# EAGLE design main (EAGLE 7.7.0)
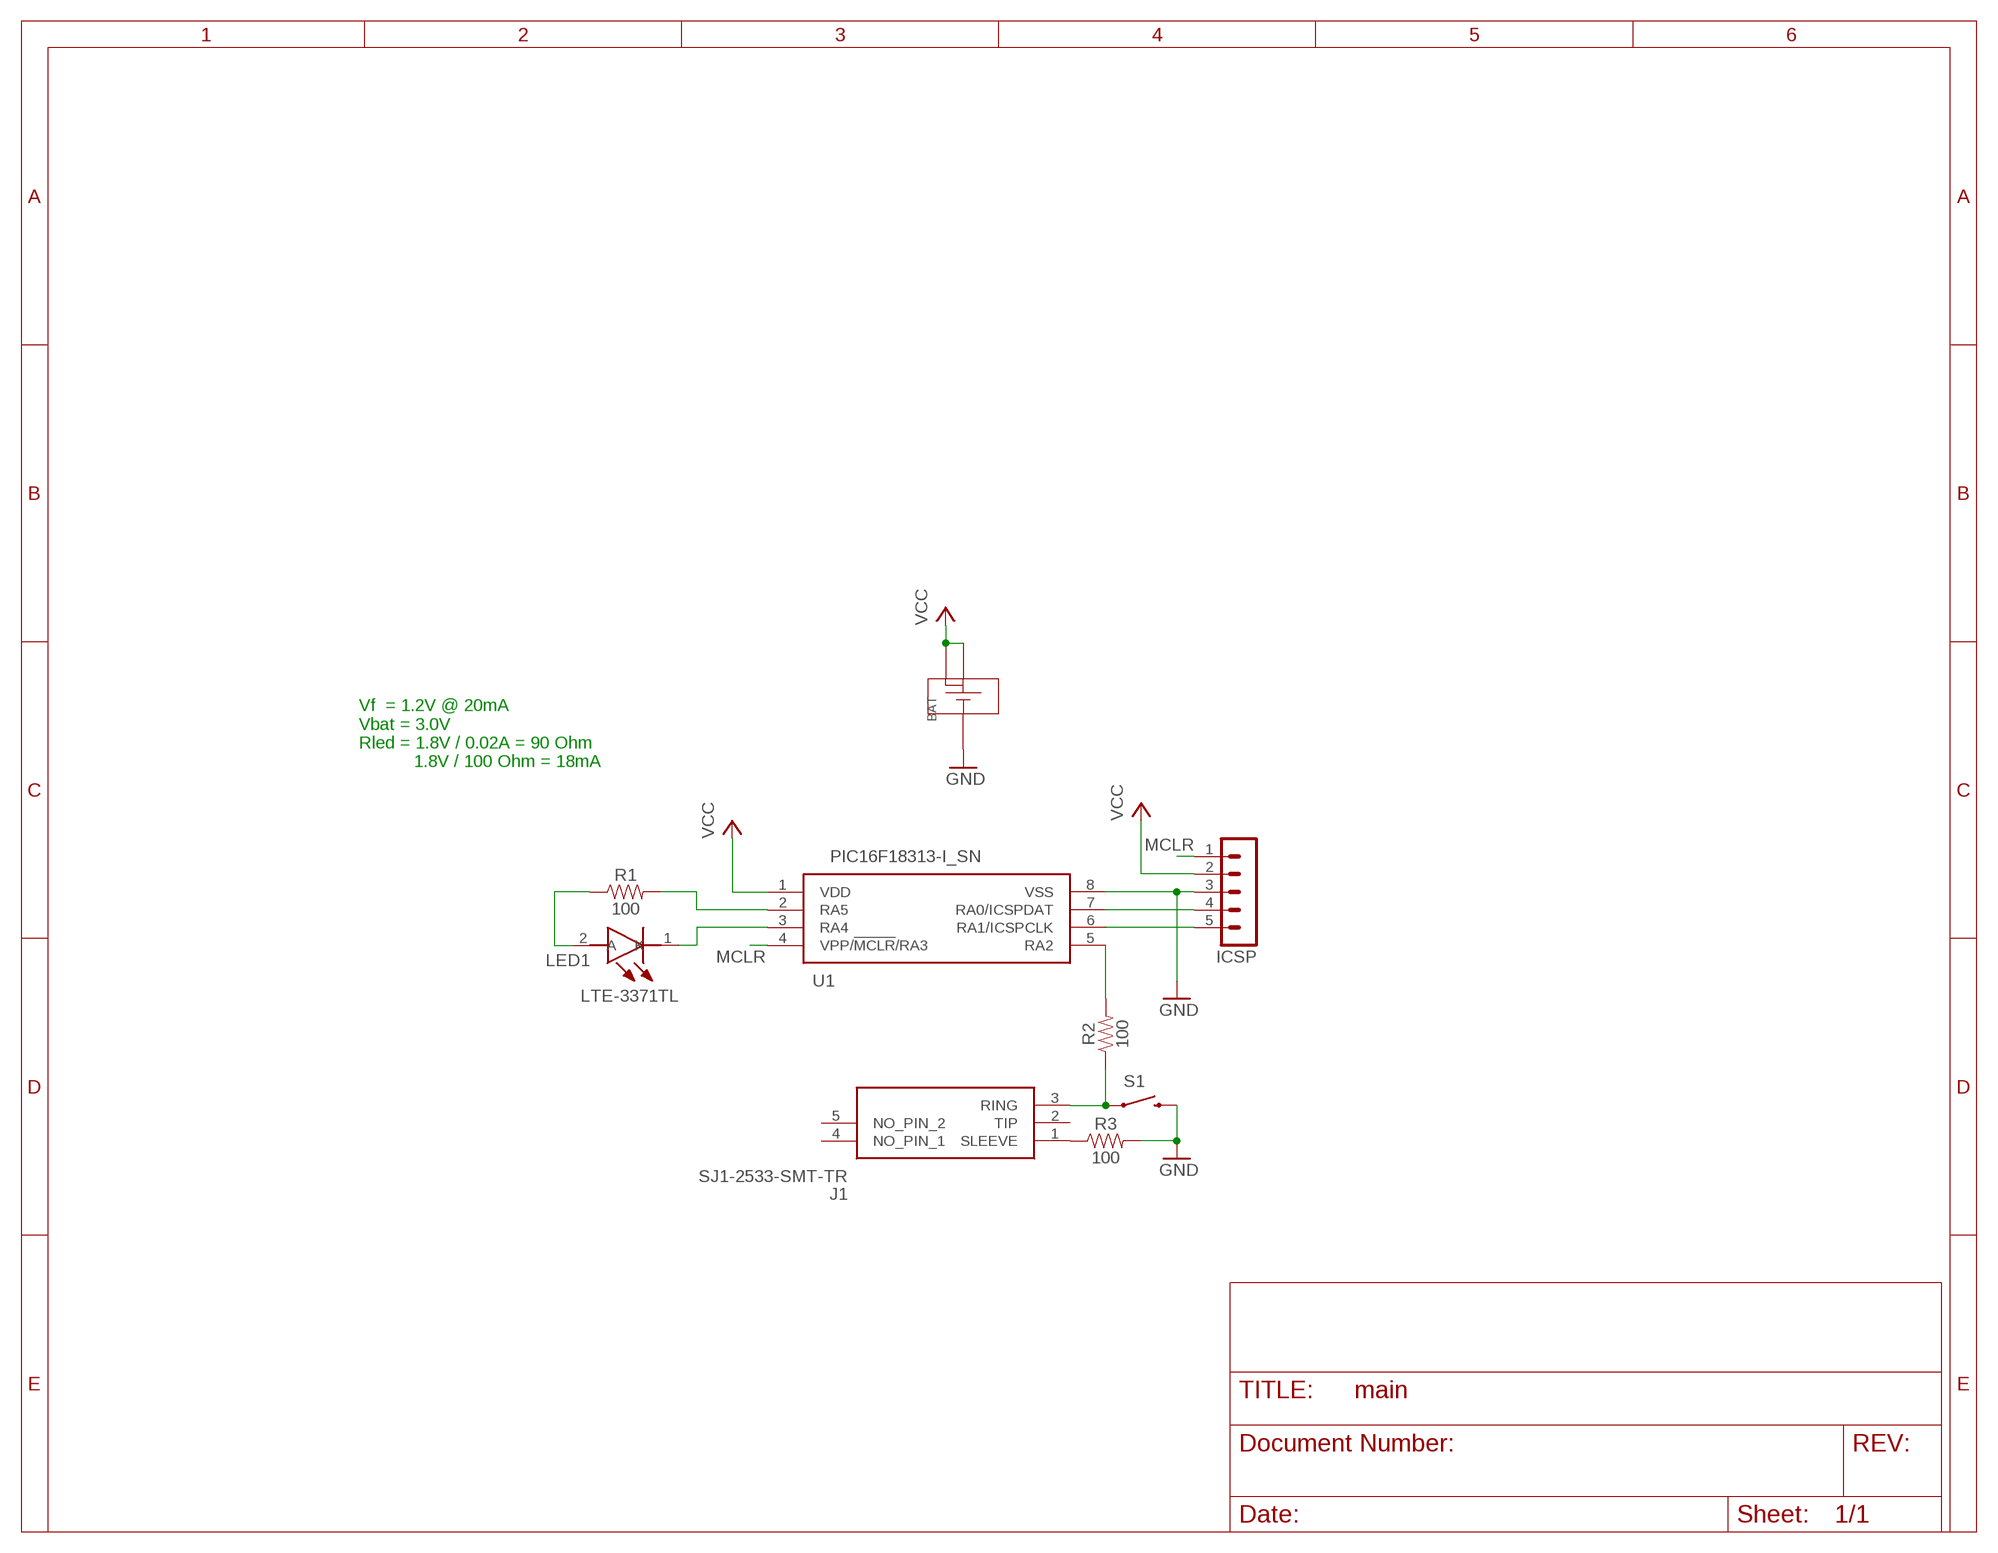
[diagram p0: schematic, sheet 1]

## Parts
BAT  SMTM1632  [SMTM1632]
ICSP  MA05-1  [MA05-1]
J1  SJ1-2533-SMT-TR  [SJ12533SMTTR]
LED1  LTE-3371TL  [LTE3371TL]
R1  100  100OHM-0603-1/10W-1%  [0603]
R2  100  100OHM-0603-1/10W-1%  [0603]
R3  100  100OHM-0603-1/10W-1%  [0603]
S1  SWITCH-MOMENTARY-2PTH  [TACTILE-PTH]
U1  PIC16F18313-I_SN  [SOIC127P600X175-8N]

## Nets
GND: BAT.1(-) ICSP.3 R3.2 S1.3 U1.8(VSS)
MCLR: ICSP.1 U1.4(VPP/!MCLR!/RA3)
N$1: R1.2 U1.2(RA5)
N$2: ICSP.4 U1.7(RA0/ICSPDAT)
N$3: ICSP.5 U1.6(RA1/ICSPCLK)
N$4: LED1.1(K) U1.3(RA4)
N$5: LED1.2(A) R1.1
N$6: J1.1(SLEEVE) R3.1
N$7: J1.3(RING) R2.1 S1.1
N$8: R2.2 U1.5(RA2)
VCC: BAT.2(+) BAT.3(+) ICSP.2 U1.1(VDD)
Unconnected: J1.2(TIP) J1.4(NO_PIN_1) J1.5(NO_PIN_2)

## Notes on the sheet
- Vf  = 1.2V @ 20mA
  Vbat = 3.0V
  Rled = 1.8V / 0.02A = 90 Ohm
             1.8V / 100 Ohm = 18mA

## Library data of the parts
BAT = AltiumKeyFobParts:SMTM1632: 16mm Coin Cell Battery Holder
ICSP = con-lstb:MA05-1: PIN HEADER; OC_FARNELL: unknown; OC_NEWARK: unknown
J1 = SamacSys_Parts:SJ1-2533-SMT-TR: Phone Connectors Audio Jacks Source: Datasheet <https://www.cuidevices.com/product/resource/sj1-253x-smt.pdf>; DESCRIPTION: Phone Connectors Audio Jacks; HEIGHT: 3.1mm; MANUFACTURER_NAME: CUI Devices; MANUFACTURER_PART_NUMBER: SJ1-2533-SMT-TR; MOUSER_PART_NUMBER: 490-SJ1-2533-SMT-TR; MOUSER_PRICE-STOCK: https://www.mouser.co.uk/ProductDetail/CUI-Devices/SJ1-2533-SMT-TR?qs=WyjlAZoYn50tDi43uXaCGg%3D%3D
LED1 = SamacSys_Parts:LTE-3371TL: Infrared Emitters Infrared 940nm 1.25V, 20mA, 140deg Source: Datasheet <https://componentsearchengine.com/Datasheets/1/LTE-3371TL.pdf>; DESCRIPTION: Infrared Emitters Infrared 940nm 1.25V, 20mA, 140deg; HEIGHT: 8.85mm; MANUFACTURER_NAME: Lite-On; MANUFACTURER_PART_NUMBER: LTE-3371TL; MOUSER_PART_NUMBER: 859-LTE-3371TL; MOUSER_PRICE-STOCK: https://www.mouser.com/Search/Refine.aspx?Keyword=859-LTE-3371TL
R1-R3 = SparkFun-Resistors:100OHM: 100Ω resistor A resistor is a passive two-terminal electrical component that implements electrical resistance as a circuit element. Resistors act to reduce current flow, and, at the same time, act to lower voltage levels within circuits. - Wikipedia; PROD_ID: RES-07863
S1 = Flash:SWITCH-MOMENTARY-2: Various NO switches- pushbuttons, reed, etc
U1 = SamacSys_Parts:PIC16F18313-I_SN: 8-bit Microcontrollers - MCU 8-Bit MCU 3.5K Flash 256 RAM 256 EEPROM Source: Datasheet <http://www.microchip.com/mymicrochip/filehandler.aspx?ddocname=en574931>; DESCRIPTION: 8-bit Microcontrollers - MCU 8-Bit MCU 3.5K Flash 256 RAM 256 EEPROM; HEIGHT: 1.75mm; MANUFACTURER_NAME: Microchip; MANUFACTURER_PART_NUMBER: PIC16F18313-I/SN; MOUSER_PART_NUMBER: 579-PIC16F18313-I/SN; MOUSER_PRICE-STOCK: https://www.mouser.co.uk/ProductDetail/Microchip-Technology/PIC16F18313-I-SN?qs=PQDAUpz3sUMAayGU2D8VYw%3D%3D

## Board
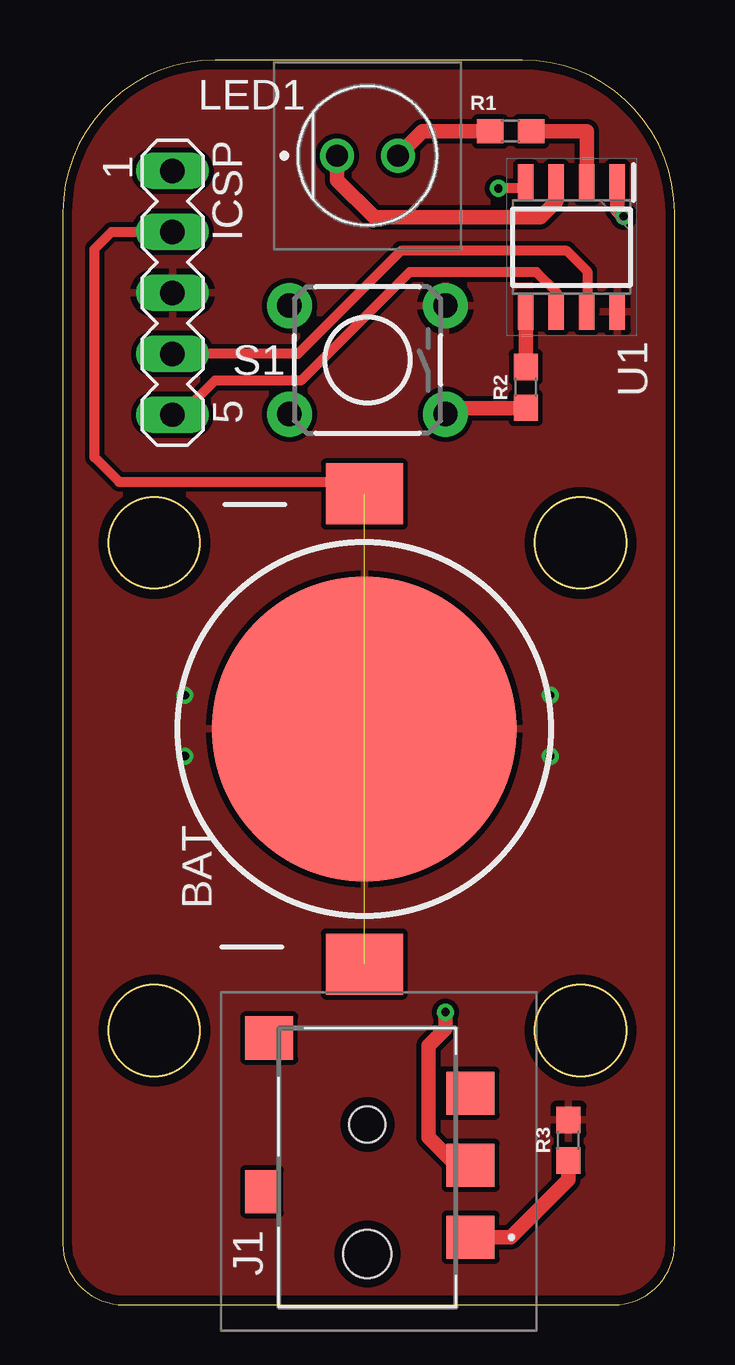
[diagram p1: board, top side]
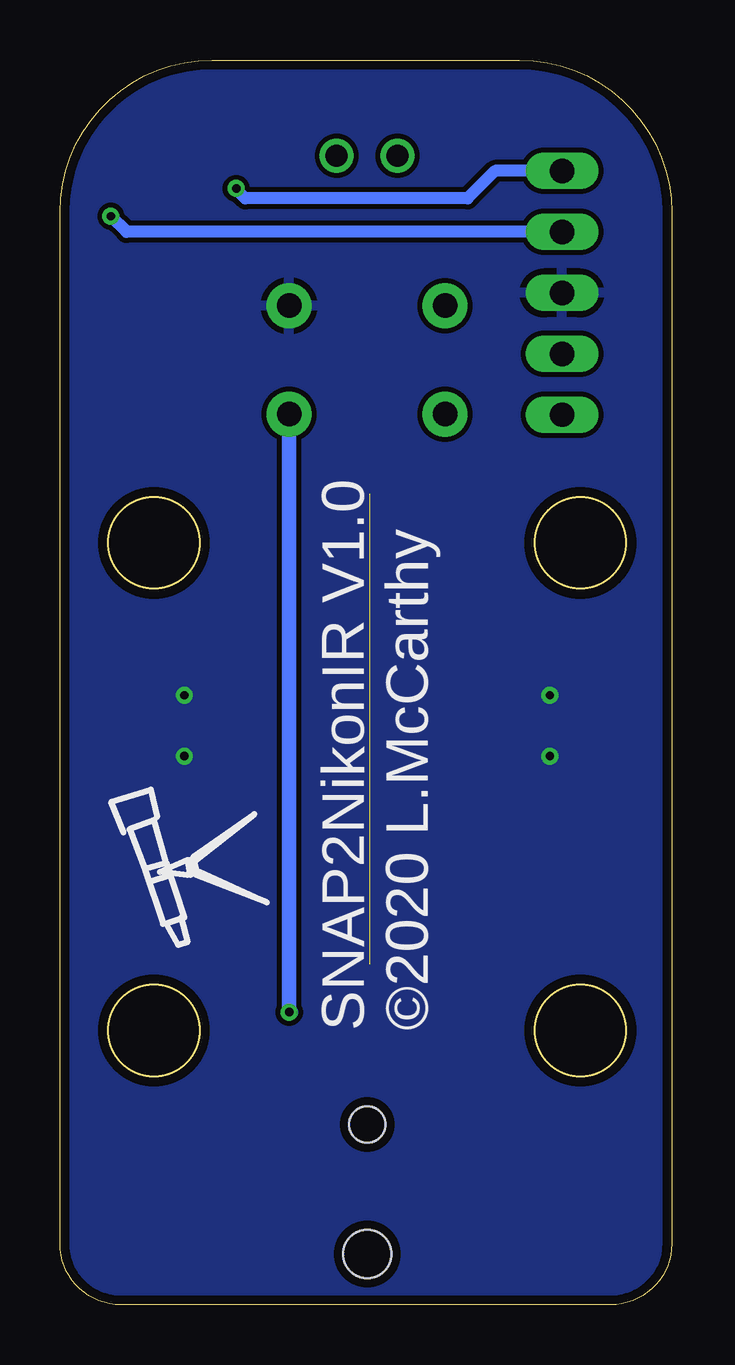
[diagram p2: board, bottom side, seen from below]

Size 25.51 x 51.87 mm. Coordinates in mm from the lower left corner, seen from the top.
Outline: 0,45.52 0,2.54 arc90 2.54,0 22.97,0 arc90 25.51,2.54 25.51,45.52 arc90 19.16,51.87 6.35,51.87 arc90 0,45.52
Outline: circle at 21.59,31.75 radius 1.91
Outline: circle at 3.81,11.43 radius 1.91
Outline: circle at 3.81,31.75 radius 1.91
Outline: circle at 21.59,11.43 radius 1.91
Copper layers (1*16): Top 0.0356mm / dielectric 1.5011mm / Bottom 0.0356mm
Design rules "ConservativeLaenPCBOrder *": minimum track width 8mil, minimum drill 13mil, track to track 8mil, track to pad 8mil, pad to pad 8mil, via to via 8mil, smd to smd 8mil, copper to edge 15mil, drill to drill 8mil, minimum pad ring 7mil, minimum via ring 7mil, stop-mask expansion 3mil, vias tented up to drill 20mil, thermal gap 10mil

### Footprints (pad centres in the part's own frame; a part is rotated, then mirrored left to right if it is on the bottom)
SMTM1632 = smd 12.7 x 12.7: 1 10.025,0 | smd 2.54 x 3.2: 2 0.229,0; 3 19.821,0
MA05-1 = drill 1.016 long: 1 -5.08,0; 2 -2.54,0; 3 0,0; 4 2.54,0; 5 5.08,0
SJ12533SMTTR = smd 1.8 x 2: 1 -2.9,-4.3; 2 5.4,4.1; 3 0.1,-4.3; 5 3.1,-4.3 | smd 1.8 x 1.4: 4 -1,4.4 | hole 2: -3.6,0 | hole 1.5: 1.8,0
LTE3371TL = drill 0.91 pad 1.416: 1 0,0; 2 2.54,0
0603 = smd 1.1 x 1: 1 -0.85,0; 2 0.85,0
TACTILE-PTH = drill 1.016 pad 1.88: 1 -3.251,2.261; 2 3.251,2.261; 3 -3.251,-2.261; 4 3.251,-2.261
SOIC127P600X175-8N = smd 1.5 x 0.65: 1 -2.7,1.905; 2 -2.7,0.635; 3 -2.7,-0.635; 4 -2.7,-1.905; 5 2.7,-1.905; 6 2.7,-0.635; 7 2.7,0.635; 8 2.7,1.905

### Placement (x,y rotation side)
BAT  12.57,13.97 90 top
ICSP  4.57,42.16 270 top
J1  12.7,5.71 90 top
LED1  11.43,47.88 0 top
R1  18.67,48.9 0 top
R2  19.3,38.23 90 top
R3  21.08,6.86 90 top
S1  12.7,39.37 180 top
U1  21.21,44.07 270 top

### Tracks (layer width: path | path; a pad name or v marks a point on that pad's centre or on a via)
GND  (via drill 0.35)
  other vias: 5.08,25.4 20.32,25.4 5.08,22.86 20.32,22.86
  pour Bottom: 0,52.07 0,0 25.53,0 25.53,52.07
  pour Top: 0,52.07 25.53,52.07 25.53,0 0,0
MCLR  (via drill 0.35)
  Top 0.406: U1.4 19.05,46.52 v18.16,46.52
  Bottom 0.508: ICSP.1 7.37,47.24 8.51,46.1 17.78,46.1 18.16,46.48 v18.16,46.52
N$1
  Top 0.61: U1.2 21.84,48.9 R1.2
N$2
  Top 0.406: 21.86,41.39 21.86,43.07 21.02,43.92 14.09,43.92 9.8,39.62 ICSP.4
  Top 0.61: U1.7 21.86,41.39
N$3
  Top 0.406: 20.59,41.39 20.59,42.18 19.75,43.03 14.45,43.03 9.93,38.51 6.33,38.51 4.91,37.08 ICSP.5
  Top 0.61: U1.6 20.59,41.39
N$4
  Top 0.61: U1.3 20.57,45.97 19.91,45.31 12.98,45.31 11.43,46.86 LED1.1
N$5
  Top 0.61: LED1.2 14.99,48.9 R1.1
N$6
  Top 0.61: J1.1 18.69,2.81 21.08,5.21 R3.1
N$7  (via drill 0.35)
  Top 0.61: R2.1 19.29,37.36 16.2,37.36 S1.1 | v15.95,12.19 15.95,11.51 15.24,10.79 15.24,6.99 16.51,5.71 16.9,5.71 J1.3
  Bottom 0.61: S1.1 15.95,12.27 15.88,12.19 v15.95,12.19
N$8
  Top 0.61: U1.5 R2.2
VCC  (via drill 0.35)  (1 unrouted)
  Top 0.406: ICSP.2 2.03,44.7 1.32,43.99 1.32,35.31 2.34,34.29 12.07,34.29 BAT.3
  Top 0.61: v23.39,45.36 23.11,45.63 U1.1
  Bottom 0.508: ICSP.2 22.73,44.7 v23.39,45.36

### Text on the board
bNames: SNAP2NikonIR V1.0 / ©2020 L.McCarthy